# EAGLE design MRCS-ODX4 v17a (EAGLE 7.7.0)
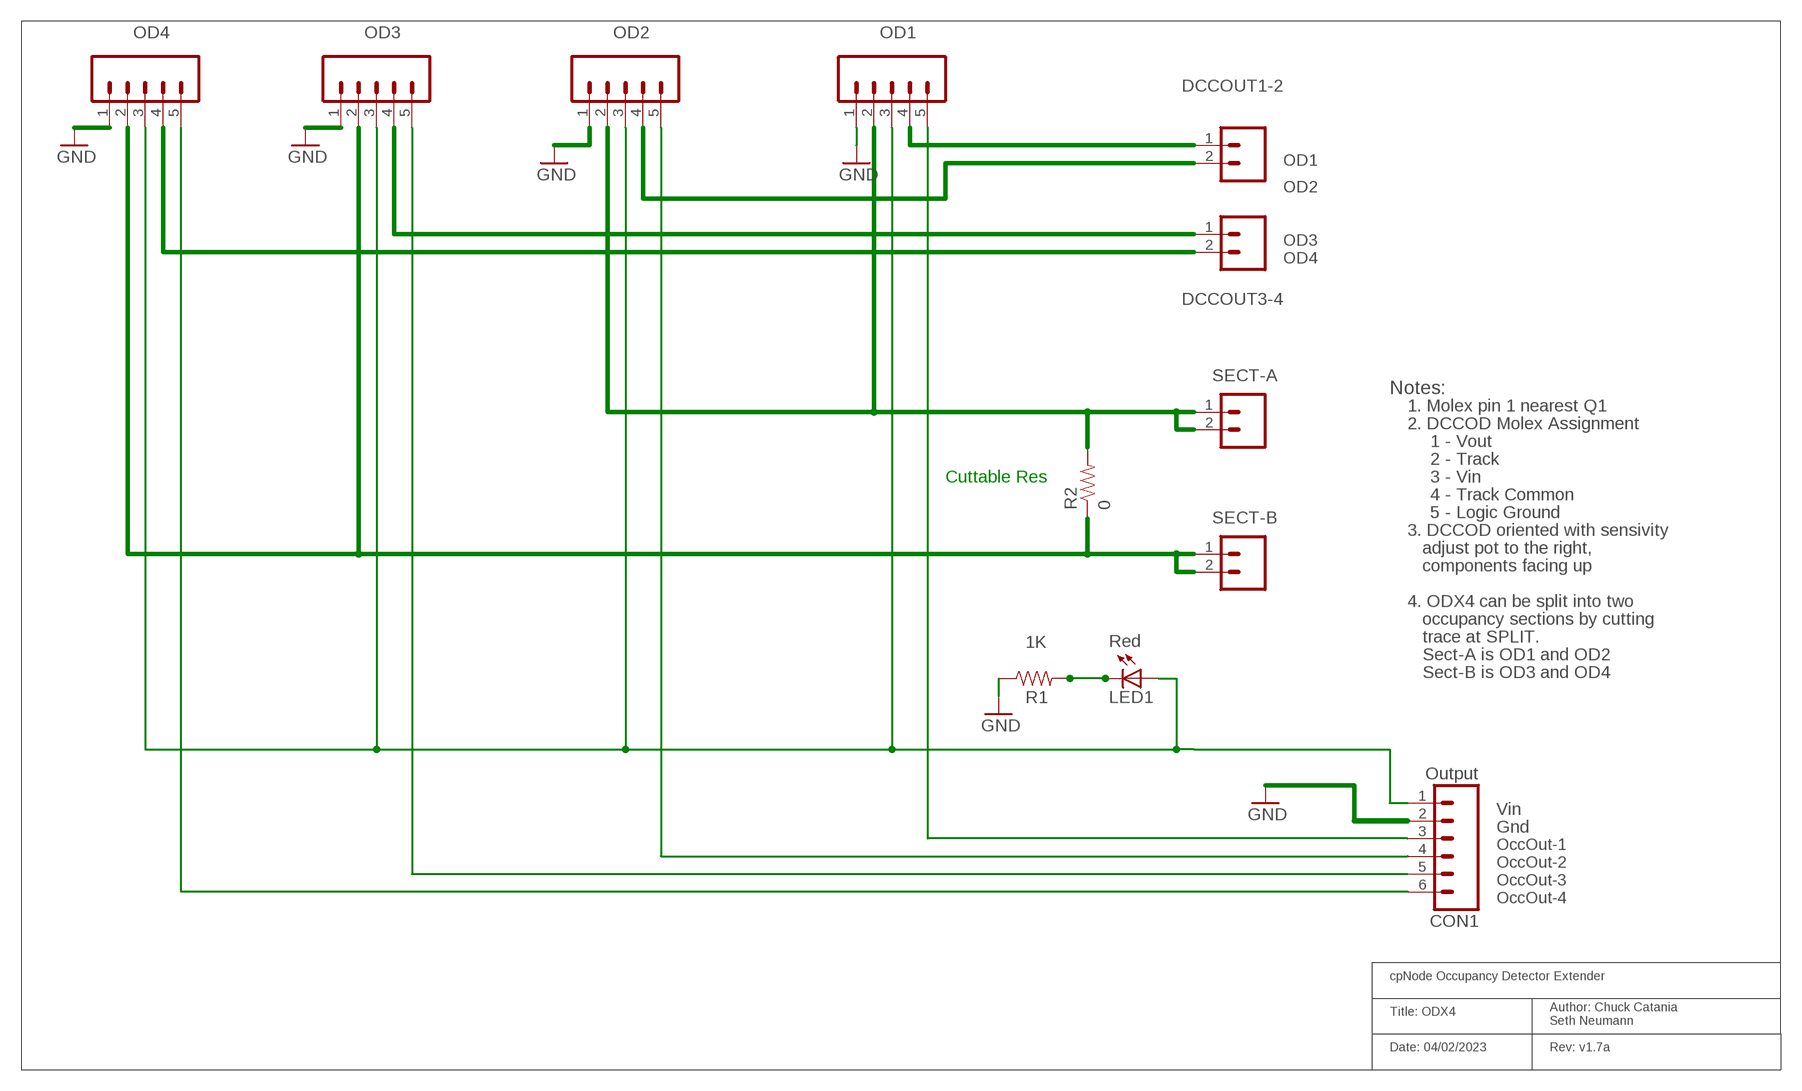
[diagram p0: schematic, sheet 1]

## Parts
CON1  Output  CONNECTOR-M06POLAR_LOCK  [MOLEX-1X6_LOCK]
DCCOUT1-2  CONNECTOR-M025MM-LOCK  [SCREWTERMINAL-5MM-2]
DCCOUT3-4  CONNECTOR-M025MM-LOCK  [SCREWTERMINAL-5MM-2]
LED1  Red  LEDLED3MM  [LED3MM]
OD1  CONNECTOR-M051.56  [KK-156-5]
OD2  CONNECTOR-M051.56  [KK-156-5]
OD3  CONNECTOR-M051.56  [KK-156-5]
OD4  CONNECTOR-M051.56  [KK-156-5]
R1  1K  RPTH04  [AXIAL-0.4-RES]
R2  0  RPTH-R0  [CUT-R]
SECT-A  M025MM  [SCREWTERMINAL-5MM-2]
SECT-B  M025MM  [SCREWTERMINAL-5MM-2]

## Nets
GND: CON1.2 OD1.1 OD2.1 OD3.1 OD4.1 R1.P$1
N$2: CON1.6 OD4.5
N$6: LED1.K(C) R1.P$2
OCCOUT1: CON1.3 OD1.5
OCCOUT2: CON1.4 OD2.5
OCCOUT3: CON1.5 OD3.5
SECT-A: OD1.2 OD2.2 R2.P1 SECT-A.1 SECT-A.2
SECT-B: OD3.2 OD4.2 R2.P2 SECT-B.1 SECT-B.2
TO1: DCCOUT1-2.1(A) OD1.4
TO2: DCCOUT1-2.2(B) OD2.4
TO3: DCCOUT3-4.1(A) OD3.4
TO4: DCCOUT3-4.2(B) OD4.4
VIN: CON1.1 LED1.A OD1.3 OD2.3 OD3.3 OD4.3

## Notes on the sheet
- OD1
- OD2
- OD3
- OD4
- Notes:
- 1. Molex pin 1 nearest Q1
- 2. DCCOD Molex Assignment
- 1 - Vout
- 2 - Track
- Cuttable Res | 3 - Vin
- 4 - Track Common
- 5 - Logic Ground
- 3. DCCOD oriented with sensivity
- adjust pot to the right,
- components facing up
- 4. ODX4 can be split into two
- occupancy sections by cutting
- trace at SPLIT.
- Sect-A is OD1 and OD2
- Sect-B is OD3 and OD4
- Vin
- Gnd
- OccOut-1
- OccOut-2
- OccOut-3
- OccOut-4
- cpNode Occupancy Detector Extender
- Title: ODX4
- Author: Chuck Catania
  Seth Neumann
- Date: 04/02/2023 | Rev: v1.7a

## Library data of the parts
CON1 = SPCoast:CONNECTOR-M06: Header 6 Standard 6-pin 0.1" header
DCCOUT1-2 DCCOUT3-4 = SPCoast:CONNECTOR-M02: PHOENIX CONNECTOR
LED1 = SPCoast:LED*
OD1-OD4 = SPCoast:CONNECTOR-M05: Header 5 Standard 5-pin 0.1" header. Use with straight break away headers (SKU : PRT-00116), right angle break away headers (PRT-00553), swiss pins (PRT-00743), machine pins (PRT-00117), and female headers (PRT-00115). Molex polarized connector foot print use with SKU : PRT-08230 with associated crimp pins and housings.
R1 R2 = SPCoast:R*: Resistor Basic schematic elements and footprints for 0603, 1206, and PTH 1/10th watt (small) resistors.
SECT-A SECT-B = SparkFun-Connectors:M02: Standard 2-pin 0.1" header. Use with - straight break away headers ( PRT-00116) - right angle break away headers (PRT-00553) - swiss pins (PRT-00743) - machine pins (PRT-00117) - female headers (PRT-00115) Molex polarized connector foot print use with: PRT-08233 with associated crimp pins and housings. 2.54_SCREWTERM for use with PRT-10571. 3.5mm Screw Terminal footprints for PRT-08084 5mm Screw Terminal footprints for use with PRT-08433

## Board
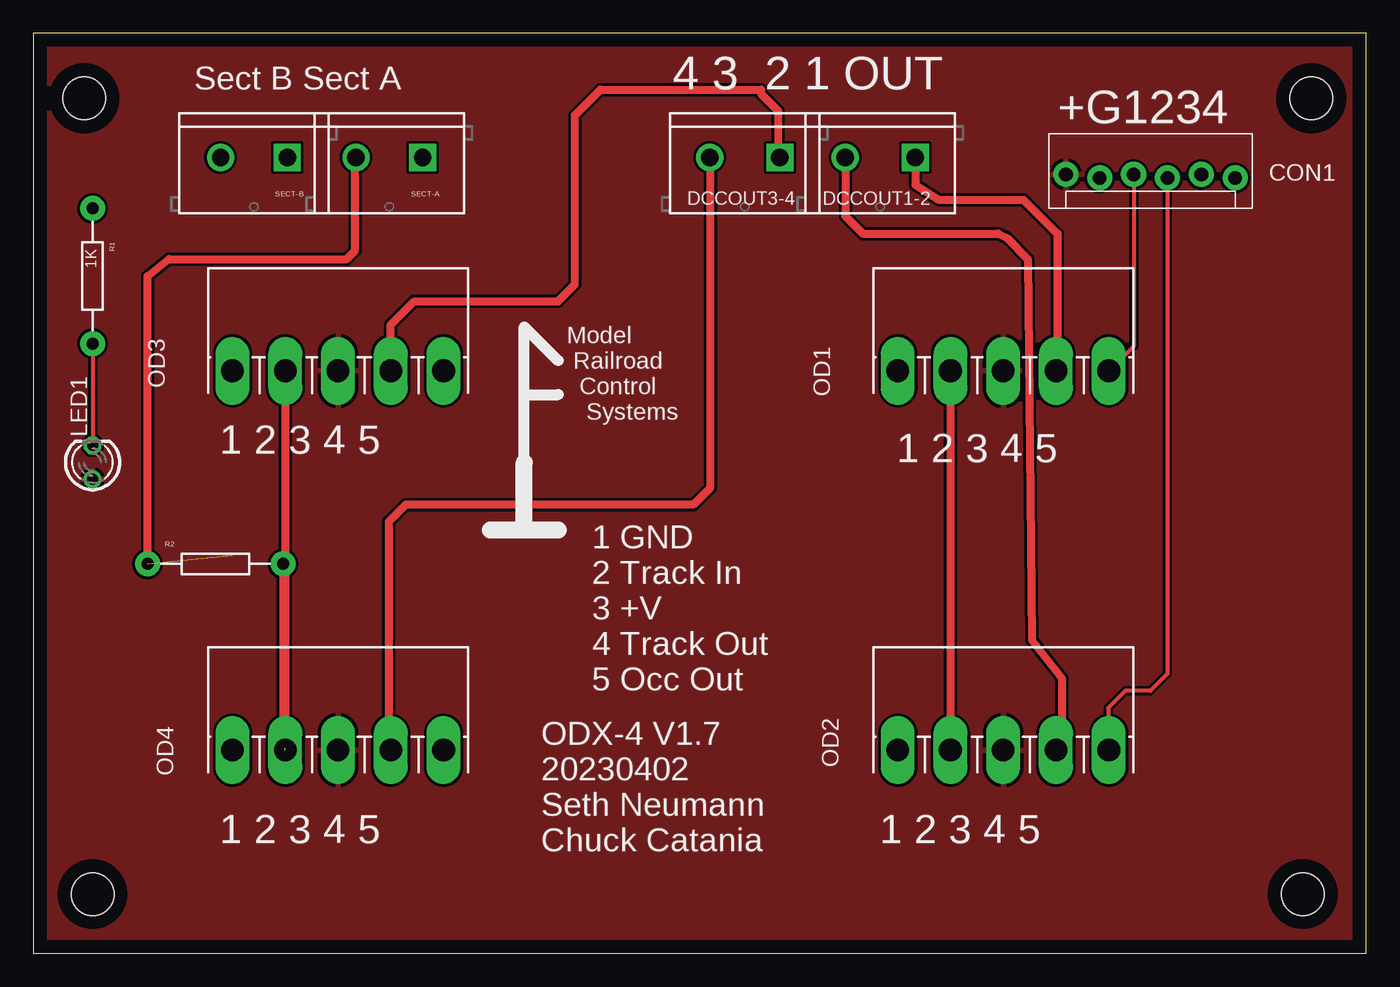
[diagram p1: board, top side]
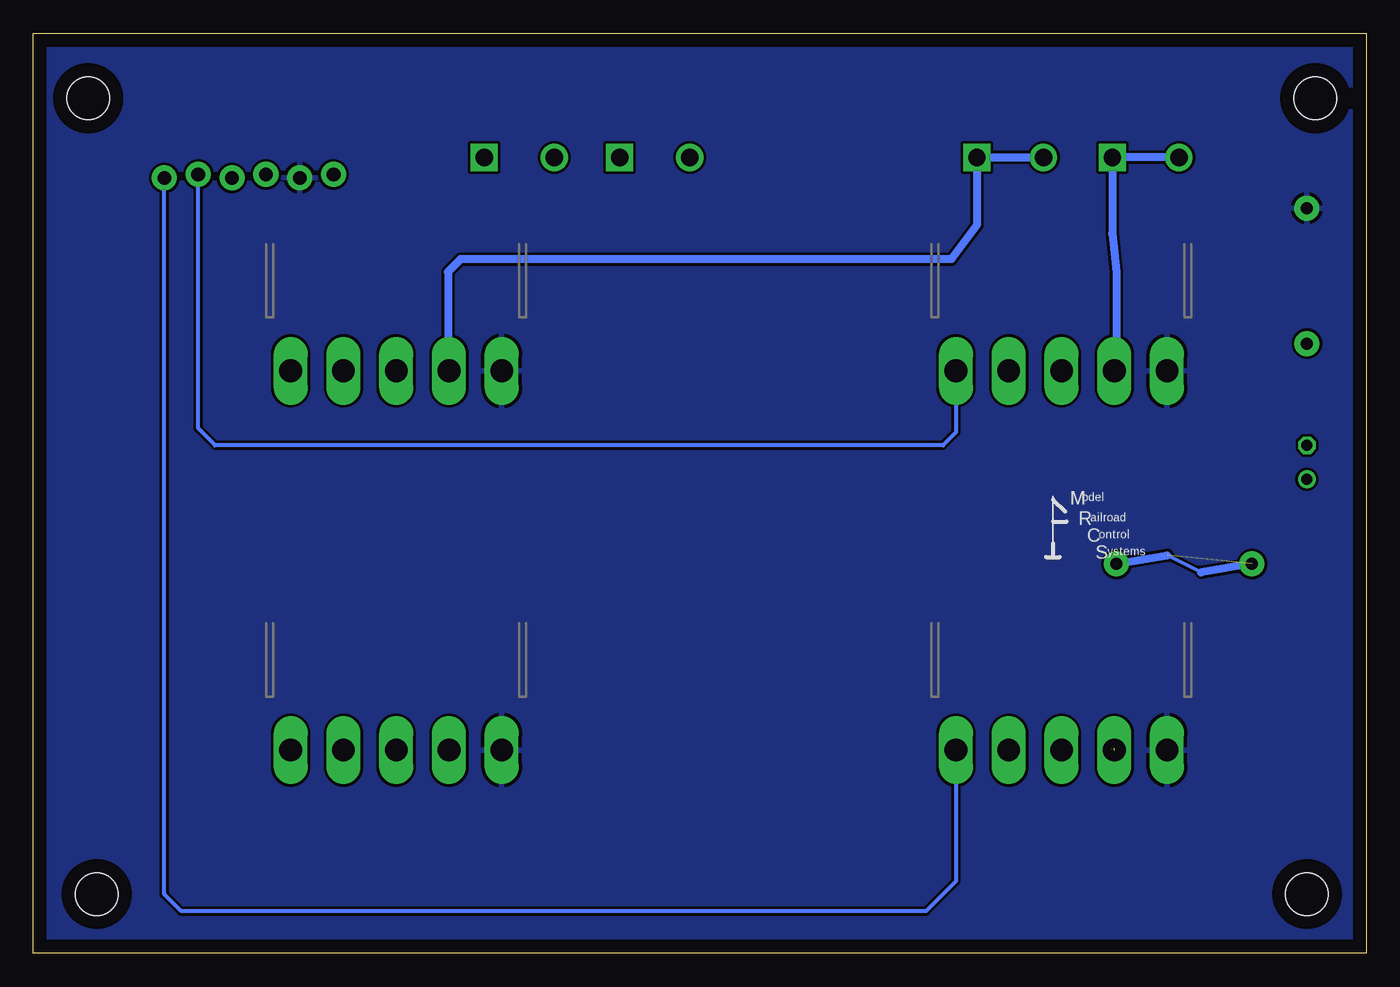
[diagram p2: board, bottom side, seen from below]

Size 100 x 69 mm. Coordinates in mm from the lower left corner, seen from the top.
Outline: 0,0 100,0 100,69 0,69 0,0
Copper layers (1*16): Top 0.035mm / dielectric 1.5mm / Bottom 0.035mm
Design rules "default": minimum track width 10mil, minimum drill 24mil, track to track 8mil, track to pad 8mil, pad to pad 8mil, via to via 8mil, smd to smd 8mil, copper to edge 40mil, drill to drill 8mil, minimum pad ring 10mil, minimum via ring 8mil, stop-mask expansion 4mil, vias tented up to drill 0mil, thermal gap 10mil
Holes 3.2 mm at 3.81,64.14 95.89,64.14 95.25,4.45 4.45,4.45

### Footprints (pad centres in the part's own frame; a part is rotated, then mirrored left to right if it is on the bottom)
MOLEX-1X6_LOCK = drill 1.016 pad 1.88: 1 0,0; 2 2.54,-0.254; 3 5.08,0; 4 7.62,-0.254; 5 10.16,0; 6 12.7,-0.254
SCREWTERMINAL-5MM-2 = drill 1.3 pad 2.032 square: 1 -0.127,0 | drill 1.3 pad 2.032: 2 5.127,0
LED3MM = drill 0.813: A 1.27,0 | drill 0.813 octagon: K -1.27,0
KK-156-5 = drill 1.7 pad 2.184 long: 1 -7.92,0; 2 -3.96,0; 3 0,0; 4 3.96,0; 5 7.92,0
AXIAL-0.4-RES = drill 0.9 pad 1.88: P$1 -5.08,0; P$2 5.08,0
CUT-R = drill 0.9 pad 1.88: P1 5.08,0; P2 -5.08,0
SCREWTERMINAL-5MM-2' = drill 1.3 pad 2.032 square: 1 0,0 | drill 1.3 pad 2.032: 2 5,0

### Placement (x,y rotation side)
CON1  77.47,58.42 0 top
DCCOUT1-2  66.04,59.69 180 top
DCCOUT3-4  55.88,59.69 180 top
LED1  4.45,36.83 270 top
OD1  72.77,43.69 0 top
OD2  72.77,15.24 0 top
OD3  22.86,43.69 0 top
OD4  22.86,15.24 0 top
R1  4.45,50.8 270 top
R2  13.65,29.21 0 top
SECT-A  M025MM  [SCREWTERMINAL-5MM-2']  29.21,59.69 180 top
SECT-B  M025MM  [SCREWTERMINAL-5MM-2']  19.05,59.69 180 top
U$1  [MRCS-LOGO]  36.83,31.75 0 top
U$2  [MRCSLOGOBTM]  17.14,29.21 0 top
U$3  [CA-PROP65WARNING]  52.7,45.09 0 top

### Tracks (layer width: path | path; a pad name or v marks a point on that pad's centre or on a via)
GND
  pour Bottom: 0,0 100.33,0 100.33,68.58 0,68.58
N$2
  Bottom 0.305: OD4.5 30.78,5.42 33.02,3.17 88.9,3.17 90.17,4.45 CON1.6
N$6
  Top 0.305: R1.P$2 LED1.K
OCCOUT1
  Top 0.305: CON1.3 82.55,45.55 OD1.5
OCCOUT2
  Top 0.305: CON1.4 85.09,20.95 83.82,19.68 81.92,19.68 80.64,18.41 80.64,15.29 OD2.5
OCCOUT3
  Bottom 0.305: 30.48,43.81 30.77,43.05 | CON1.5 87.63,39.37 86.36,38.1 31.75,38.1 30.77,39.08 30.77,43.05 | OD3.5 30.78,43.06 30.77,43.05
SECT-A  (1 unrouted)
  Top 0.61: 8.57,29.21 8.57,50.8 10.16,52.07 23.5,52.07 24.13,52.7 24.13,59.61 SECT-A.2 | OD1.2 OD2.2
  Bottom 0.61: OD1.2 68.9,43.77 68.9,51.12 67.94,52.07 31.11,52.07 29.21,54.61 SECT-A.1 SECT-A.2
SECT-B  (2 unrouted)
  Top 0.61: OD3.2 18.9,15.39 18.9,14.61 18.73,16.04 18.73,29.21
  Bottom 0.61: SECT-B.2 SECT-B.1 19.05,53.98 18.73,51.12 18.73,43.85 OD3.2
TO1
  Top 0.61: DCCOUT1-2.1 66.17,57.66 67.94,56.52 74.3,56.52 76.83,53.98 76.83,43.79 OD1.4
TO2
  Top 0.61: DCCOUT1-2.2 60.91,55.29 62.23,53.98 72.39,53.98 73.03,53.66 74.61,52.07 74.93,23.5 77.15,20.64 77.15,15.66 OD2.4
TO3
  Top 0.61: OD3.4 26.82,47.14 28.57,48.9 39.37,48.9 40.64,50.16 40.64,62.87 42.55,64.77 54.61,64.77 54.61,64.45 55.88,63.18 55.88,59.82 DCCOUT3-4.1
TO4
  Top 0.61: DCCOUT3-4.2 50.8,59.64 50.8,34.92 49.53,33.66 27.94,33.66 26.67,32.38 26.67,15.39 OD4.4
VIN
  pour Top: 0,0 100.33,0 100.33,68.58 0,68.58

### Text on the board
tPlace: Sect B Sect A | 4 3 2 1 OUT | +G1234 | 1 2 3 4 5 | 1 2 3 4 5 | 1 GND / 2 Track In / 3 +V / 4 Track Out / 5 Occ Out | 1 2 3 4 5 | ODX-4 V1.7 / 20230402 / Seth Neumann / Chuck Catania | 1 2 3 4 5